# Altium schematic sheet 3S Battery Schematic.SchDoc
size A4
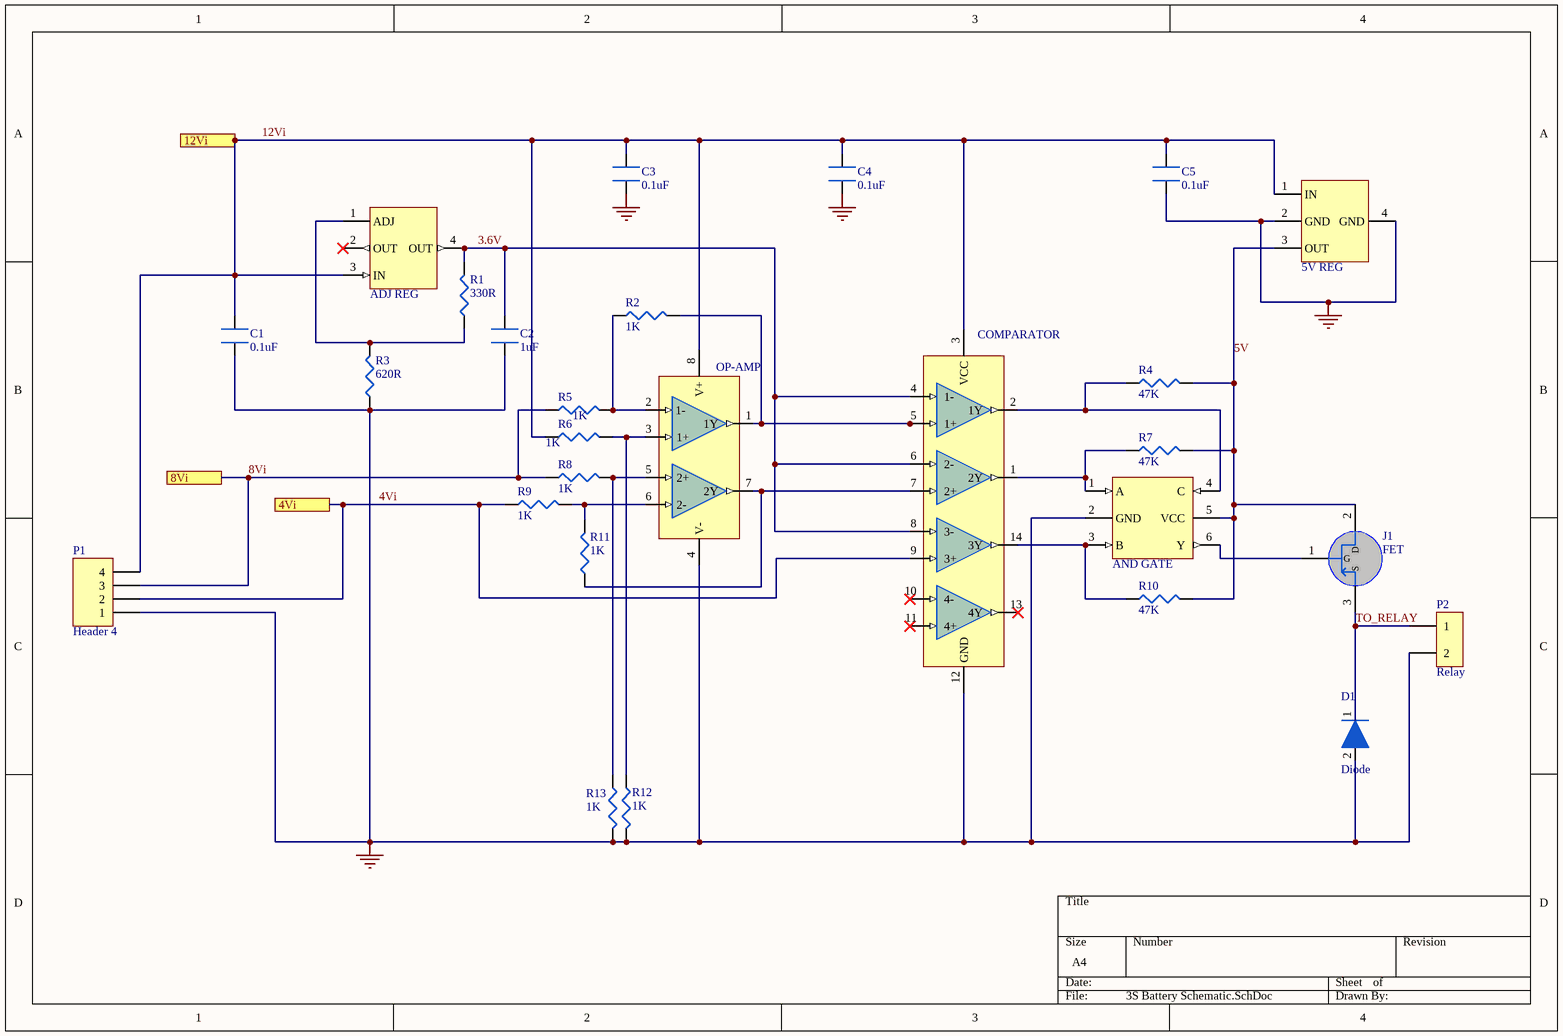
[diagram p0: 3S Battery Schematic.SchDoc]

## Parts
5VREG  5V REG  [5VREG]
ADJ1  ADJ REG  [ADJREG]
AND1  AND GATE  [AND3]
C1  0.1uF  [C1206]
C2  1uF  [C1206]
C3  0.1uF  [C1206]
C4  0.1uF  [C1206]
C5  0.1uF  [C1206]
COMP1  COMPARATOR  [Comparator]
D1  Diode  [Diode]
J1  FET  [MOSFET]
OPAMP1  OP-AMP  [OPAMP 2-Circuit]
P1  Header 4  [HDR1X4]
P2  Relay  [HDR1X2]
R1  330R  [R1206]
R2  1K  [R1206]
R3  620R  [R1206]
R4  47K  [R1206]
R5  1K  [R1206]
R6  1K  [R1206]
R7  47K  [R1206]
R8  1K  [R1206]
R9  1K  [R1206]
R10  47K  [R1206]
R11  1K  [R1206]
R12  1K  [R1206]
R13  1K  [R1206]

## Ports
4Vi, 8Vi, 12Vi

## Nets
GND: 5VREG.2(GND) 5VREG.4(GND) AND1.2(GND) C1.1 C2.1 C3.1 C4.1 C5.1 COMP1.12(GND) D1.2 OPAMP1.4(V-) P1.1 P2.2 R3.1 R12.2 R13.2
3.6V: ADJ1.4(OUT) C2.2 COMP1.4(1-) COMP1.6(2-) COMP1.8(3-) R1.2
4Vi: COMP1.9(3+) P1.2 R9.1 ; port 4Vi
5V: 5VREG.3(OUT) AND1.5(VCC) J1.2(D) R4.2 R7.2 R10.2
8Vi: P1.3 R5.1 R8.1 ; port 8Vi
12Vi: 5VREG.1(IN) ADJ1.3(IN) C1.2 C3.2 C4.2 C5.2 COMP1.3(VCC) OPAMP1.8(V+) P1.4 R6.1 ; port 12Vi
TO_RELAY: D1.1 J1.3(S) P2.1
NetADJ1_1: ADJ1.1(ADJ) R1.1 R3.2
NetAND1_1: AND1.1(A) COMP1.1(2Y) R7.1
NetAND1_3: AND1.3(B) COMP1.14(3Y) R10.1
NetAND1_4: AND1.4(C) COMP1.2(1Y) R4.1
NetAND1_6: AND1.6(Y) J1.1(G)
NetCOMP1_5: COMP1.5(1+) OPAMP1.1(1Y) R2.2
NetCOMP1_7: COMP1.7(2+) OPAMP1.7(2Y) R11.1
NetOPAMP1_2: OPAMP1.2(1-) R2.1 R5.2
NetOPAMP1_3: OPAMP1.3(1+) R6.2 R12.1
NetOPAMP1_5: OPAMP1.5(2+) R8.2 R13.1
NetOPAMP1_6: OPAMP1.6(2-) R9.2 R11.2

Not connected (* = marked no-connect by the designer): ADJ1 2(OUT)*; COMP1 10(4-)* 11(4+)* 13(4Y)*

## Library data of the parts
5VREG = LM7805MPX/NOPB: IC REG LINEAR 5V 1.5A SOT223-4; Manufacturer: Texas Instruments; Quiescent Current: 8mA; Dropout Voltage: 2V; Supplier 1: Digi-Key; Supplier Part Number 1: 296-44518-1-ND; Manufacturer Part Number: LM7805MPX/NOPB; RoHS: No; Category: Voltage Regulators - Linear; Stock 1: 3420; Pricing 1: 1=1.32000, 10=1.18000, 25=1.12000, 100=0.86000, 250=0.76000, 500=0.72000, 1000=0.56000 (USD); Min Operating Temperature: 0°C; Max Operating Temperature: 125°C; Lead Free: Lead Free
ADJ1 = LM317DCYR: TEXAS INSTRUMENTS - LM317DCYR - LINEAR VOLT REG, 1.5A, 1.25V-37V, SOT223; Power Supply Rejection Ratio (PSRR): 64dB; Output Type: Adjustable; Number of Regulators: 1; Polarity: Positive; Reference Voltage: 1.3V; Min Output Voltage: 1.25V; Max Output Voltage: 37V; Quiescent Current: 3.5mA; Dropout Voltage: 2V; Min Input Voltage: 4.2V; Max Input Voltage: 40V; Supplier 1: Digi-Key; Supplier Part Number 1: 296-12602-1-ND; Manufacturer: Texas Instruments; Manufacturer Part Number: LM317DCYR; RoHS: Yes; Category: Voltage Regulators - Linear; Stock 1: 100644; Pricing 1: 1=0.60000, 10=0.52800, 25=0.49600, 100=0.37600, 250=0.32000, 500=0.30400, 1000=0.23200 (USD); Mount: Surface Mount; Case/Package: SOT-223; Number of Pins: 4; Weight: 0.006632oz; Contact Plating: Tin,Matte; Min Operating Temperature: 0°C; Max Operating Temperature: 125°C; Number of Outputs: 1; Output Voltage: 37V; Packaging: Tape and Reel; Output Current: 1.5A; Max Output Current: 1.5A; Package Quantity: 1; Length: 6.5mm; Height: 1.6mm; Width: 3.5mm; Radiation Hardening: No; REACH SVHC: No SVHC; Lead Free: Lead Free; ComponentLink1URL: https://datasheet.ciiva.com/2042/lm317-2042144.pdf?src-supplier=Digi-Key; ComponentLink1Description: https://datasheet.ciiva.com/2042/lm317-2042144.pdf?src-supplier=Digi-Key; ComponentLink2URL: https://datasheet.ciiva.com/4882/slvs044u-120651-4882417.pdf?src-supplier=Mouser; ComponentLink2Description: https://datasheet.ciiva.com/4882/slvs044u-120651-4882417.pdf?src-supplier=Mouser; ComponentLink3URL: https://datasheet.ciiva.com/41458/001014031-da-01-en-ic-reg-adj-1-5a-lm317dcyr-sot-223-4-tid-41458183.pdf?src-supplier=Conrad; ComponentLink3Description: https://datasheet.ciiva.com/41458/001014031-da-01-en-ic-reg-adj-1-5a-lm317dcyr-sot-223-4-tid-41458183.pdf?src-supplier=Conrad; ComponentLink4URL: https://datasheet.ciiva.com/2042/lm317-2042145.pdf?src-supplier=Digi-Key; ComponentLink4Description: https://datasheet.ciiva.com/2042/lm317-2042145.pdf?src-supplier=Digi-Key; ComponentLink5URL: https://datasheet.ciiva.com/2042/lm317-2042146.pdf?src-supplier=Digi-Key; ComponentLink5Description: https://datasheet.ciiva.com/2042/lm317-2042146.pdf?src-supplier=Digi-Key; ComponentLink6URL: https://datasheet.ciiva.com/46385/1885815-46385689.pdf?src-supplier=Element14; ComponentLink6Description: https://datasheet.ciiva.com/46385/1885815-46385689.pdf?src-supplier=Element14
AND1 = SN74LVC1G11DCKR: IC GATE AND 1CH 3-INP SC-70-6; Manufacturer: Texas Instruments; Number of Elements: 1; Propagation Delay: 3.5ns; Max Supply Voltage: 5.5V; Min Supply Voltage: 1.65V; Number of Inputs: 3; Output Current: 32mA; Quiescent Current: 10uA; High Level Output Current: -32mA; Turn-On Delay Time: 4.9ns; Schmitt Trigger Input: No; Supplier 1: Digi-Key; Supplier Part Number 1: 296-18066-1-ND; Manufacturer Part Number: SN74LVC1G11DCKR; RoHS: Yes; Category: Logic Gates; Stock 1: 75205; Pricing 1: 1=0.43000, 10=0.32000, 25=0.28000, 100=0.18120, 250=0.15000, 500=0.12000, 1000=0.09200 (USD); Mount: Surface Mount; Case/Package: SC; Number of Pins: 6; Weight: 8.8E-05oz; Contact Plating: Gold; Min Operating Temperature: -40°C; Max Operating Temperature: 125°C; Package Quantity: 1; Packaging: Tape and Reel; Logic Function: AND; Number of Outputs: 1; Number of Circuits: 1; Low Level Output Current: 32mA; Number of Gates: 1; Number of Input Lines: 3; Number of Output Lines: 1; Number of Bits: 1; Length: 2mm; Height: 0.9mm; Width: 1.25mm; Radiation Hardening: No; REACH SVHC: No SVHC; Lead Free: Lead Free; ComponentLink1URL: https://datasheet.ciiva.com/4216/901sn74lvc1g11-4216653.pdf?src-supplier=Arrow; ComponentLink1Description: https://datasheet.ciiva.com/4216/901sn74lvc1g11-4216653.pdf?src-supplier=Arrow; ComponentLink2URL: https://datasheet.ciiva.com/34301/756561-34301472.pdf?src-supplier=Jameco; ComponentLink2Description: https://datasheet.ciiva.com/34301/756561-34301472.pdf?src-supplier=Jameco; ComponentLink3URL: https://datasheet.ciiva.com/15090/getdatasheetpartid-173081-15090972.pdf?src-supplier=Verical; ComponentLink3Description: https://datasheet.ciiva.com/15090/getdatasheetpartid-173081-15090972.pdf?src-supplier=Verical; ComponentLink4URL: https://datasheet.ciiva.com/14290/sn74lvc1g11-14290749.pdf?src-supplier=Avnet; ComponentLink4Description: https://datasheet.ciiva.com/14290/sn74lvc1g11-14290749.pdf?src-supplier=Avnet; ComponentLink5URL: https://datasheet.ciiva.com/1864/sn74lvc1g11-1864149.pdf?src-supplier=Digi-Key; ComponentLink5Description: https://datasheet.ciiva.com/1864/sn74lvc1g11-1864149.pdf?src-supplier=Digi-Key; ComponentLink6URL: https://datasheet.ciiva.com/1864/sn74lvc1g11-1864150.pdf?src-supplier=Digi-Key; ComponentLink6Description: https://datasheet.ciiva.com/1864/sn74lvc1g11-1864150.pdf?src-supplier=Digi-Key; ComponentLink7URL: https://datasheet.ciiva.com/1864/sn74lvc1g11-1864151.pdf?src-supplier=Digi-Key; ComponentLink7Description: https://datasheet.ciiva.com/1864/sn74lvc1g11-1864151.pdf?src-supplier=Digi-Key; ComponentLink8URL: https://datasheet.ciiva.com/26218/sn74lvc1g11-26218392.pdf?src-supplier=Avnet+Europe; ComponentLink8Description: https://datasheet.ciiva.com/26218/sn74lvc1g11-26218392.pdf?src-supplier=Avnet+Europe; ComponentLink9URL: https://datasheet.ciiva.com/7783/sn74lvc1g11-7783449.pdf?src-supplier=Element14; ComponentLink9Description: https://datasheet.ciiva.com/7783/sn74lvc1g11-7783449.pdf?src-supplier=Element14; ComponentLink10URL: https://datasheet.ciiva.com/28695/1882071-28695898.pdf?src-supplier=Element14; ComponentLink10Description: https://datasheet.ciiva.com/28695/1882071-28695898.pdf?src-supplier=Element14; ComponentLink11URL: https://datasheet.ciiva.com/46439/1856273-46439162.pdf?src-supplier=Element14; ComponentLink11Description: https://datasheet.ciiva.com/46439/1856273-46439162.pdf?src-supplier=Element14; ComponentLink12URL: https://datasheet.ciiva.com/46439/1856273-46439210.pdf?src-supplier=Element14; ComponentLink12Description: https://datasheet.ciiva.com/46439/1856273-46439210.pdf?src-supplier=Element14
C1 C3-C5 = C1206C104K5RAC-TU: Kemet 0.1µF ±10% 50V dc X7R Dielectric SMD Ceramic Multilayer Capacitor; 1206 pa; Capacitance: 100nF; Supplier 1: Digi-Key; Supplier Part Number 1: 399-C1206C104K5RAC7800CT-ND; Manufacturer: KEMET; Manufacturer Part Number: C1206C104K5RAC-TU; RoHS: Yes; Category: Ceramic Capacitors; Stock 1: 1706426; Pricing 1: 1=0.12000, 10=0.08400, 50=0.04760, 100=0.03950, 500=0.02768, 1000=0.02291 (USD); Mount: Surface Mount; Case/Package: 1206; Number of Pins: 2; Case Code (Imperial): 1206; Case Code (Metric): 3216; Contact Plating: Tin,Matte; Dielectric Material: Ceramic; Min Operating Temperature: -55°C; Max Operating Temperature: 125°C; Packaging: Tape and Reel; Tolerance: 10%; Voltage Rating (DC): 50V; Dielectric: X7R; Voltage Rating: 50V; Package Quantity: 4000; Termination: SMD/SMT; Voltage: 50V; Length: 3.2mm; Height: 0.78mm; Width: 1.6mm; Depth: 1.6mm; Radiation Hardening: No; REACH SVHC: No SVHC; ComponentLink1URL: https://datasheet.ciiva.com/6125/1725438-6125494.pdf?src-supplier=Farnell; ComponentLink1Description: https://datasheet.ciiva.com/6125/1725438-6125494.pdf?src-supplier=Farnell; ComponentLink2URL: https://datasheet.ciiva.com/6125/kem-c1002-x7r-smd-6125493.pdf?src-supplier=Farnell; ComponentLink2Description: https://datasheet.ciiva.com/6125/kem-c1002-x7r-smd-6125493.pdf?src-supplier=Farnell; ComponentLink3URL: https://datasheet.ciiva.com/14584/70095383-14584998.pdf?src-supplier=Allied+Electronics; ComponentLink3Description: https://datasheet.ciiva.com/14584/70095383-14584998.pdf?src-supplier=Allied+Electronics; ComponentLink4URL: https://datasheet.ciiva.com/6094/kem-c1002-x7r-smd-6094137.pdf?src-supplier=Farnell; ComponentLink4Description: https://datasheet.ciiva.com/6094/kem-c1002-x7r-smd-6094137.pdf?src-supplier=Farnell; ComponentLink5URL: https://datasheet.ciiva.com/14589/70095383-14589050.pdf?src-supplier=Allied+Electronics; ComponentLink5Description: https://datasheet.ciiva.com/14589/70095383-14589050.pdf?src-supplier=Allied+Electronics; ComponentLink6URL: https://datasheet.ciiva.com/7729/1851736-7729804.pdf?src-supplier=Element14; ComponentLink6Description: https://datasheet.ciiva.com/7729/1851736-7729804.pdf?src-supplier=Element14; ComponentLink7URL: https://datasheet.ciiva.com/7730/kem-c1002-x7r-smd-7730076.pdf?src-supplier=Element14; ComponentLink7Description: https://datasheet.ciiva.com/7730/kem-c1002-x7r-smd-7730076.pdf?src-supplier=Element14; ComponentLink8URL: https://datasheet.ciiva.com/7729/1851736-7729805.pdf?src-supplier=Element14; ComponentLink8Description: https://datasheet.ciiva.com/7729/1851736-7729805.pdf?src-supplier=Element14; ComponentLink9URL: https://datasheet.ciiva.com/7730/kem-c1002-x7r-smd-7730077.pdf?src-supplier=Element14; ComponentLink9Description: https://datasheet.ciiva.com/7730/kem-c1002-x7r-smd-7730077.pdf?src-supplier=Element14; ComponentLink10URL: https://datasheet.ciiva.com/32426/slceramic-chip-condensers-e-32426463.pdf?src-supplier=Distrelec; ComponentLink10Description: https://datasheet.ciiva.com/32426/slceramic-chip-condensers-e-32426463.pdf?src-supplier=Distrelec; ComponentLink11URL: https://datasheet.ciiva.com/5423/kem-c1002-x7r-smd-5423254.pdf?src-supplier=Mouser; ComponentLink11Description: https://datasheet.ciiva.com/5423/kem-c1002-x7r-smd-5423254.pdf?src-supplier=Mouser; ComponentLink12URL: https://datasheet.ciiva.com/28682/1851736-28682249.pdf?src-supplier=Element14; ComponentLink12Description: https://datasheet.ciiva.com/28682/1851736-28682249.pdf?src-supplier=Element14
C2 = C1206C105M4RACTU: KEMET         C1206C105M4RACTU             SMD Multilayer Ceramic Capacitor, 1206 [3216 Metric], 1 F, 16 V,  20%, X7R, C Series                          New; Voltage Rating: 16V; Supplier 1: Digi-Key; Supplier Part Number 1: 399-8150-1-ND; Manufacturer: KEMET; Manufacturer Part Number: C1206C105M4RACTU; RoHS: Yes; Category: Ceramic Capacitors; Stock 1: 36978; Pricing 1: 1=0.19000, 10=0.12600, 50=0.07560, 100=0.06390, 500=0.04372, 1000=0.03868 (USD); Mount: Surface Mount; Case/Package: 1206; Dielectric Material: Ceramic; Case Code (Imperial): 1206; Case Code (Metric): 3216; Min Operating Temperature: -55°C; Max Operating Temperature: 125°C; Termination: SMD/SMT; Dielectric: X7R; Capacitance: 1uF; Tolerance: 20%; Packaging: Tape and Reel; Package Quantity: 1; Voltage Rating (DC): 16V; Length: 3.2mm; Height: 1.2mm; Thickness: 0.055inch; Depth: 1.6mm; Width: 0.063inch; Radiation Hardening: No; REACH SVHC: No SVHC; ComponentLink1URL: http://components.arrow.com/part/dataview/0323_00341530?src-supplier=Arrow+Europe; ComponentLink1Description: http://components.arrow.com/part/dataview/0323_00341530?src-supplier=Arrow+Europe; ComponentLink2URL: http://www.farnell.com/datasheets/2746114.pdf?src-supplier=Farnell; ComponentLink2Description: http://www.farnell.com/datasheets/2746114.pdf?src-supplier=Farnell; ComponentLink3URL: http://www.mouser.com/ds/2/212/KEM_C1002_X7R_SMD-1102033.pdf?src-supplier=Mouser; ComponentLink3Description: http://www.mouser.com/ds/2/212/KEM_C1002_X7R_SMD-1102033.pdf?src-supplier=Mouser; ComponentLink4URL: http://www.farnell.com/datasheets/2746114.pdf?src-supplier=Newark; ComponentLink4Description: http://www.farnell.com/datasheets/2746114.pdf?src-supplier=Newark; ComponentLink5URL: http://www.farnell.com/datasheets/1828800.pdf?src-supplier=Newark; ComponentLink5Description: http://www.farnell.com/datasheets/1828800.pdf?src-supplier=Newark; ComponentLink6URL: https://api.kemet.com/component-edge/download/datasheet/C1206C105M4RACTU.pdf?src-supplier=Digi-Key; ComponentLink6Description: https://api.kemet.com/component-edge/download/datasheet/C1206C105M4RACTU.pdf?src-supplier=Digi-Key; ComponentLink7URL: http://components.arrow.com/part/dataview/2096582S3494707N7429?src-supplier=Arrow; ComponentLink7Description: http://components.arrow.com/part/dataview/2096582S3494707N7429?src-supplier=Arrow; ComponentLink8URL: https://search.kemet.com/component-edge/download/datasheet/C1206C105M4RACTU.pdf?src-supplier=Digi-Key; ComponentLink8Description: https://search.kemet.com/component-edge/download/datasheet/C1206C105M4RACTU.pdf?src-supplier=Digi-Key; ComponentLink9URL: https://www.verical.com/server-webapp/html/getDatasheet?partID=110809&src-supplier=Verical; ComponentLink9Description: https://www.verical.com/server-webapp/html/getDatasheet?partID=110809&src-supplier=Verical; ComponentLink10URL: http://www.farnell.com/datasheets/2065007.pdf?src-supplier=Element14; ComponentLink10Description: http://www.farnell.com/datasheets/2065007.pdf?src-supplier=Element14
COMP1 = LM339DR: Comparator Quad 15V/30V 14-Pin SOIC T/R; Manufacturer: Texas Instruments; Voltage Gain: 106.02dB; Min Supply Voltage: 2V; Max Supply Voltage: 30V; Min Dual Supply Voltage: 1V; Max Dual Supply Voltage: 15V; Nominal Supply Current: 2mA; Number of Elements: 4; Max Supply Current: 500uA; Input Bias Current: 250nA; Output Current per Channel: 6mA; Input Offset Voltage (Vos): 5mV; Response Time: 1.3us; Output Current: 20mA; Quiescent Current: 2.5mA; Output Type: TTL; Supplier 1: Digi-Key; Supplier Part Number 1: 296-1013-1-ND; Manufacturer Part Number: LM339DR; RoHS: Yes; Category: Amplifiers - Op Amps, Buffer, Instrumentation; Stock 1: 39253; Pricing 1: 1=0.38000, 10=0.28700, 25=0.25840, 100=0.14100, 250=0.13632, 500=0.12220, 1000=0.09400 (USD); Mount: Surface Mount; Case/Package: SOIC; Number of Pins: 14; Weight: 0.004318oz; Contact Plating: Gold; Min Operating Temperature: 0°C; Max Operating Temperature: 70°C; Packaging: Tape and Reel; Package Quantity: 2500; Number of Channels: 4; Max Input Current: 250nA; Radiation Hardening: No; Lead Free: Lead Free; REACH SVHC: No SVHC; ComponentLink1URL: https://datasheet.ciiva.com/15131/getdatasheetpartid-242797-15131064.pdf?src-supplier=Verical; ComponentLink1Description: https://datasheet.ciiva.com/15131/getdatasheetpartid-242797-15131064.pdf?src-supplier=Verical; ComponentLink2URL: https://datasheet.ciiva.com/34301/902741-34301710.pdf?src-supplier=Jameco; ComponentLink2Description: https://datasheet.ciiva.com/34301/902741-34301710.pdf?src-supplier=Jameco; ComponentLink3URL: https://datasheet.ciiva.com/2970/lm2901-2970486.pdf?src-supplier=Avnet; ComponentLink3Description: https://datasheet.ciiva.com/2970/lm2901-2970486.pdf?src-supplier=Avnet; ComponentLink4URL: https://datasheet.ciiva.com/2970/lm2901-2970487.pdf?src-supplier=Avnet; ComponentLink4Description: https://datasheet.ciiva.com/2970/lm2901-2970487.pdf?src-supplier=Avnet; ComponentLink5URL: https://datasheet.ciiva.com/46390/1874704-46390521.pdf?src-supplier=Element14; ComponentLink5Description: https://datasheet.ciiva.com/46390/1874704-46390521.pdf?src-supplier=Element14; ComponentLink6URL: https://datasheet.ciiva.com/1483/1633630-1483053.pdf?src-supplier=Element14; ComponentLink6Description: https://datasheet.ciiva.com/1483/1633630-1483053.pdf?src-supplier=Element14; ComponentLink7URL: https://datasheet.ciiva.com/1827/lm139a-1827181.pdf?src-supplier=Digi-Key; ComponentLink7Description: https://datasheet.ciiva.com/1827/lm139a-1827181.pdf?src-supplier=Digi-Key; ComponentLink8URL: https://datasheet.ciiva.com/1827/lm139a-1827182.pdf?src-supplier=Digi-Key; ComponentLink8Description: https://datasheet.ciiva.com/1827/lm139a-1827182.pdf?src-supplier=Digi-Key; ComponentLink9URL: https://datasheet.ciiva.com/1827/lm139a-1827183.pdf?src-supplier=Digi-Key; ComponentLink9Description: https://datasheet.ciiva.com/1827/lm139a-1827183.pdf?src-supplier=Digi-Key; ComponentLink10URL: https://datasheet.ciiva.com/16464/lm2901-16464303.pdf?src-supplier=Avnet+Asia; ComponentLink10Description: https://datasheet.ciiva.com/16464/lm2901-16464303.pdf?src-supplier=Avnet+Asia; ComponentLink11URL: https://datasheet.ciiva.com/48711/001072944-da-01-en-ic-quad-diff-comp-lm339dr-soic-14-tid-48711414.pdf?src-supplier=Conrad; ComponentLink11Description: https://datasheet.ciiva.com/48711/001072944-da-01-en-ic-quad-diff-comp-lm339dr-soic-14-tid-48711414.pdf?src-supplier=Conrad
D1 = S1B: ON SEMICONDUCTOR - S1B - Standard Recovery Diode, General Purpose, 100 V, 1 A, Single, 1.1 V, 1.8 µs, 30 A; Manufacturer: ON Semiconductor / Fairchild; Forward Voltage: 1.1V; Voltage Rating (DC): 100V; Current Rating: 1A; Capacitance: 12pF; Reverse Recovery Time: 1.8us; Max Surge Current: 40A; Peak Reverse Current: 1uA; Recovery Time: 1800ns; Power Dissipation: 1.4W; Peak Non-Repetitive Surge Current: 30A; Supplier 1: Digi-Key; Supplier Part Number 1: S1BFSCT-ND; Manufacturer Part Number: S1B; RoHS: Yes; Category: Rectifier Diodes; Stock 1: 104255; Pricing 1: 1=0.24000, 10=0.19200, 25=0.16120, 100=0.07880, 500=0.06570, 1000=0.04565, 2500=0.04242 (USD); Mount: Surface Mount; Case/Package: SMA; Number of Pins: 2; Weight: 0.106g; Contact Plating: Tin,Matte; Min Operating Temperature: -55°C; Max Operating Temperature: 150°C; Packaging: Tape and Reel; Polarity: Standard; Output Current: 1A; Max Repetitive Reverse Voltage (Vrrm): 100V; Reverse Voltage: 100V; Package Quantity: 1; Forward Current: 1A; Element Configuration: Single; Average Rectified Current: 1A; Max Forward Surge Current (Ifsm): 30A; Max Reverse Voltage (DC): 100V; Length: 4.75mm; Height: 2.2mm; Width: 2.95mm; Radiation Hardening: No; Lead Free: Lead Free; REACH SVHC: No SVHC; ComponentLink1URL: https://datasheet.ciiva.com/4452/s1b-196602-4452914.pdf?src-supplier=Mouser; ComponentLink1Description: https://datasheet.ciiva.com/4452/s1b-196602-4452914.pdf?src-supplier=Mouser; ComponentLink2URL: https://datasheet.ciiva.com/25624/0900766b810e25be-25624908.pdf?src-supplier=RSComponents; ComponentLink2Description: https://datasheet.ciiva.com/25624/0900766b810e25be-25624908.pdf?src-supplier=RSComponents; ComponentLink3URL: https://datasheet.ciiva.com/916/s1a-916901.pdf?src-supplier=Digi-Key; ComponentLink3Description: https://datasheet.ciiva.com/916/s1a-916901.pdf?src-supplier=Digi-Key; ComponentLink4URL: https://datasheet.ciiva.com/916/s1a-916902.pdf?src-supplier=Digi-Key; ComponentLink4Description: https://datasheet.ciiva.com/916/s1a-916902.pdf?src-supplier=Digi-Key; ComponentLink5URL: https://datasheet.ciiva.com/916/s1a-916903.pdf?src-supplier=Digi-Key; ComponentLink5Description: https://datasheet.ciiva.com/916/s1a-916903.pdf?src-supplier=Digi-Key
J1 = DMN65D8L-7: N-Channel Enhancement MOSFET SOT-23; Manufacturer: Diodes; FET Type: 1 N-Channel; Number of Channels: 1; Rise Time: 2.8ns; Rds On Max: 3R; Input Capacitance: 22pF; Element Configuration: Single; Gate to Source Voltage (Vgs): 20V; Drain to Source Voltage (Vdss): 60V; Continuous Drain Current (ID): 310mA; Max Power Dissipation: 370mW; Drain to Source Resistance: 2R; Power Dissipation: 540mW; Turn-Off Delay Time: 12.6ns; Turn-On Delay Time: 2.7ns; Threshold Voltage: 2V; Supplier 1: Digi-Key; Supplier Part Number 1: DMN65D8L-7DICT-ND; Manufacturer Part Number: DMN65D8L-7; RoHS: Yes; Category: MOSFETs; Stock 1: 514497; Pricing 1: 1=0.17000, 10=0.15100, 25=0.14400, 100=0.06330, 250=0.06076, 500=0.04972, 1000=0.03453 (USD); Mount: Surface Mount; Case/Package: SOT-23; Number of Pins: 3; Weight: 0.000282oz; Min Operating Temperature: -55°C; Max Operating Temperature: 150°C; Packaging: Tape and Reel; Package Quantity: 1; Drain to Source Breakdown Voltage: 60V; Number of Elements: 1; Length: 3mm; Height: 1.1mm; Width: 1.4mm; Lead Free: Lead Free; REACH SVHC: No SVHC; ComponentLink1URL: https://datasheet.ciiva.com/6371/dmn65d8l-6371124.pdf?src-supplier=Digi-Key; ComponentLink1Description: https://datasheet.ciiva.com/6371/dmn65d8l-6371124.pdf?src-supplier=Digi-Key; ComponentLink2URL: https://datasheet.ciiva.com/13058/dmn65d8l-219098-13058455.pdf?src-supplier=Mouser; ComponentLink2Description: https://datasheet.ciiva.com/13058/dmn65d8l-219098-13058455.pdf?src-supplier=Mouser; ComponentLink3URL: https://datasheet.ciiva.com/6371/dmn65d8l-6371126.pdf?src-supplier=Digi-Key; ComponentLink3Description: https://datasheet.ciiva.com/6371/dmn65d8l-6371126.pdf?src-supplier=Digi-Key; ComponentLink4URL: https://datasheet.ciiva.com/6371/dmn65d8l-6371128.pdf?src-supplier=Digi-Key; ComponentLink4Description: https://datasheet.ciiva.com/6371/dmn65d8l-6371128.pdf?src-supplier=Digi-Key
OPAMP1 = LMC662AIMX/NOPB: TEXAS INSTRUMENTS   LMC662AIMX/NOPB   OP-AMP, 1.4MHZ, 1.1V/US, SOIC-8; Max Supply Voltage: 15.5V; Min Supply Voltage: 4.75V; Voltage Gain: 126.02dB; Number of Circuits: 2; Output Current: 21mA; Slew Rate: 1.1V/µs; Common Mode Rejection Ratio: 70dB; Input Offset Voltage (Vos): 3mV; Supplier 1: Digi-Key; Supplier Part Number 1: LMC662AIMX/NOPBCT-ND; Manufacturer: Texas Instruments; Manufacturer Part Number: LMC662AIMX/NOPB; RoHS: Yes; Category: Amplifiers - Op Amps, Buffer, Instrumentation; Stock 1: 33461; Pricing 1: 1=1.73000, 10=1.55600, 25=1.46760, 100=1.17400, 250=1.02724, 500=0.99790, 1000=0.79245 (USD); Mount: Surface Mount; Case/Package: SOIC; Number of Pins: 8; Min Operating Temperature: -40°C; Max Operating Temperature: 85°C; Gain Bandwidth Product: 1.4MHz; Number of Channels: 2; Unity Gain Bandwidth Product: 1.4MHz; Packaging: Tape and Reel; Bandwidth: 1.4MHz; Number of Amplifiers: 2; Number of Elements: 2; Power Supply Rejection Ratio (PSRR): 70dB; Lead Free: Lead Free; REACH SVHC: No SVHC; ComponentLink1URL: http://components.arrow.com/part/dataview/53774360S9849188N1317?src-supplier=Arrow; ComponentLink1Description: http://components.arrow.com/part/dataview/53774360S9849188N1317?src-supplier=Arrow; ComponentLink2URL: http://components.arrow.com/part/dataview/0323_00059640?src-supplier=Arrow+Europe; ComponentLink2Description: http://components.arrow.com/part/dataview/0323_00059640?src-supplier=Arrow+Europe; ComponentLink3URL: http://www.ti.com/general/docs/lit/getliterature.tsp?genericPartNumber=LMC662&&fileType=pdf&src-supplier=Avnet; ComponentLink3Description: http://www.ti.com/general/docs/lit/getliterature.tsp?genericPartNumber=LMC662&&fileType=pdf&src-supplier=Avnet; ComponentLink4URL: http://www.ti.com/lit/ds/symlink/lmc662.pdf?src-supplier=Digi-Key; ComponentLink4Description: http://www.ti.com/lit/ds/symlink/lmc662.pdf?src-supplier=Digi-Key; ComponentLink5URL: http://www.farnell.com/datasheets/1839249.pdf?src-supplier=Element14; ComponentLink5Description: http://www.farnell.com/datasheets/1839249.pdf?src-supplier=Element14; ComponentLink6URL: http://www.ti.com/general/docs/lit/getliterature.tsp?genericPartNumber=LMC662&&fileType=pdf&src-supplier=Farnell; ComponentLink6Description: http://www.ti.com/general/docs/lit/getliterature.tsp?genericPartNumber=LMC662&&fileType=pdf&src-supplier=Farnell; ComponentLink7URL: http://www.ti.com/litv/SNOSC51B?src-supplier=Mouser; ComponentLink7Description: http://www.ti.com/litv/SNOSC51B?src-supplier=Mouser; ComponentLink8URL: http://www.ti.com/general/docs/suppproductinfo.tsp?distId=10&amp;gotoUrl=http%3A%2F%2Fwww.ti.com%2Flit%2Fgpn%2Flmc662&src-supplier=Digi-Key; ComponentLink8Description: http://www.ti.com/general/docs/suppproductinfo.tsp?distId=10&amp;gotoUrl=http%3A%2F%2Fwww.ti.com%2Flit%2Fgpn%2Flmc662&src-supplier=Digi-Key; ComponentLink9URL: http://www.farnell.com/datasheets/1888942.pdf?src-supplier=Element14; ComponentLink9Description: http://www.farnell.com/datasheets/1888942.pdf?src-supplier=Element14
P1 = Header 4: Header, 4-Pin; LatestRevisionDate: 17-Jul-2002; LatestRevisionNote: Re-released for DXP Platform.; Publisher: Altium Limited
P2 = 22-29-2021: Conn Wire to Board HDR 2 POS 2.54mm Solder ST Thru-Hole Bag; Manufacturer: Molex; Number of Positions: 2; Connector Type: Header,Male Pin; Gender: Male; Voltage Rating (DC): 250V; Contact Post Length: 0.14inch; Glow Wire Compliant: Non-compliant; Supplier 1: Digi-Key; Manufacturer Part Number: 22-29-2021; RoHS: Yes; Category: Connectors; Stock 1: 6742; Pricing 1: 1=0.48000, 10=0.45200, 100=0.31630, 500=0.27112, 1000=0.22593, 5000=0.19365, 10000=0.18074 (USD); Mount: Through Hole; Color: White; Contact Plating: Gold; Contact Material: Brass; Contact Shape: Square; Insulation Material: Nylon; Insulation Color: Natural; Max Operating Temperature: 80°C; Number of Rows: 1; Packaging: Bag; Termination: Solder; Fastening Type: Friction; Contact Mating Length: 0.295inch; Insulation Height: 0.461inch; Lead Free: Lead Free; Halogen Free: Low Halogen; Flammability Rating: UL94 V-0; ComponentLink1URL: https://datasheet.ciiva.com/70131/022292021-sd-70131706.pdf?src-supplier=Digi-Key; ComponentLink1Description: https://datasheet.ciiva.com/70131/022292021-sd-70131706.pdf?src-supplier=Digi-Key; Supplier Part Number 1: WM2744-ND
R1 = RC1206FR-07330RL: Surface Mount Thick Film Resistor, RC Series, 330 ohm, 250 mW, - 1%, 200 V, 1206 [3216 Metric]; Manufacturer: Yageo; Power Rating: 250mW; Temperature Coefficient: 100ppm/°C; Voltage Rating: 200V; Supplier 1: Digi-Key; Supplier Part Number 1: 311-330FRCT-ND; Manufacturer Part Number: RC1206FR-07330RL; RoHS: Yes; Category: Chip SMD Resistors; Stock 1: 22261; Pricing 1: 1=0.10000, 10=0.06900, 100=0.02800, 1000=0.01259, 2500=0.01092 (USD); Case/Package: 1206; Case Code (Imperial): 1206; Case Code (Metric): 3216; Min Operating Temperature: -55°C; Max Operating Temperature: 155°C; Tolerance: 1%; Resistance: 330R; Packaging: Tape and Reel; Termination: SMD/SMT; Composition: Thick Film; Length: 3.1mm; Height: 0.55mm; Depth: 1.6mm; REACH SVHC: Unknown; Lead Free: Lead Free; ComponentLink1URL: https://datasheet.ciiva.com/11819/0900766b80c6630a-11819921.pdf?src-supplier=RSComponents; ComponentLink1Description: https://datasheet.ciiva.com/11819/0900766b80c6630a-11819921.pdf?src-supplier=RSComponents; ComponentLink2URL: https://datasheet.ciiva.com/17422/pyu-rc1206-51-rohs-l-4-17422588.pdf?src-supplier=Future+Electronics; ComponentLink2Description: https://datasheet.ciiva.com/17422/pyu-rc1206-51-rohs-l-4-17422588.pdf?src-supplier=Future+Electronics
R2 R5 R6 R8 R9 R11-R13 = RC1206JR-071KL: RES SMD 1K OHM 5% 1/4W 1206; Manufacturer: Yageo; Temperature Coefficient: 100ppm/°C; Resistance: 1kR; Max Power Dissipation: 250mW; Voltage Rating: 200V; Supplier 1: Digi-Key; Supplier Part Number 1: 311-1.0KERDKR-ND; Manufacturer Part Number: RC1206JR-071KL; RoHS: Yes; Category: Chip SMD Resistors; Stock 1: 2065133; Pricing 1: 1=0.10000, 10=0.05900, 100=0.02400, 1000=0.01079, 2500=0.00936 (USD); Case/Package: 1206; Case Code (Metric): 3216; Case Code (Imperial): 1206; Min Operating Temperature: -55°C; Max Operating Temperature: 155°C; Composition: Thick Film; Tolerance: 5%; Packaging: Tape and Reel; Number of Terminations: 2; Termination: SMD/SMT; Military Standard: Not; Package Quantity: 1; Power Rating: 250mW; Length: 3.1mm; Height: 0.026inch; Width: 0.063inch; Depth: 1.6mm; Lead Free: Lead Free; REACH SVHC: Unknown; ComponentLink1URL: https://datasheet.ciiva.com/2458/pyu-r-int-thick-7-2458672.pdf?src-supplier=Digi-Key; ComponentLink1Description: https://datasheet.ciiva.com/2458/pyu-r-int-thick-7-2458672.pdf?src-supplier=Digi-Key; ComponentLink2URL: https://datasheet.ciiva.com/2458/pyu-r-int-thick-7-2458673.pdf?src-supplier=Digi-Key; ComponentLink2Description: https://datasheet.ciiva.com/2458/pyu-r-int-thick-7-2458673.pdf?src-supplier=Digi-Key; ComponentLink3URL: https://datasheet.ciiva.com/2458/pyu-r-int-thick-7-2458671.pdf?src-supplier=Digi-Key; ComponentLink3Description: https://datasheet.ciiva.com/2458/pyu-r-int-thick-7-2458671.pdf?src-supplier=Digi-Key
R3 = RMCF1206JT620R: Res Thick Film 1206 620 Ohm 5% 1/4W ±200ppm/C Molded SMD Paper T/R; Manufacturer: Stackpole Electronics; Max Power Dissipation: 250mW; Temperature Coefficient: 200ppm/°C; Supplier 1: Digi-Key; Supplier Part Number 1: RMCF1206JT620RCT-ND; Manufacturer Part Number: RMCF1206JT620R; RoHS: Yes; Category: Chip SMD Resistors; Stock 1: 44910; Pricing 1: 1=0.10000, 10=0.02700, 100=0.01100, 1000=0.00496, 2500=0.00430 (USD); Mount: Surface Mount; Case/Package: 1206; Case Code (Metric): 3216; Case Code (Imperial): 1206; Contact Plating: Tin,Matte; Min Operating Temperature: -55°C; Max Operating Temperature: 155°C; Features: Automotive AEC-Q200; Resistance: 620R; Tolerance: 5%; Packaging: Tape and Reel; Composition: Thick Film; Number of Terminations: 2; Military Standard: Not; Length: 0.126inch; Height: 0.028inch; Width: 0.063inch; Depth: 1.6mm; Radiation Hardening: No; ComponentLink1URL: https://datasheet.ciiva.com/15193/getdatasheetpartid-659413-15193755.pdf?src-supplier=Verical; ComponentLink1Description: https://datasheet.ciiva.com/15193/getdatasheetpartid-659413-15193755.pdf?src-supplier=Verical
R4 R7 R10 = CRGP1206F47K: RS20-0400S4S4SDAPHHXX.X.; Manufacturer: TE Connectivity; Supplier 1: Digi-Key; Supplier Part Number 1: A130558CT-ND; Manufacturer Part Number: CRGP1206F47K; RoHS: No; Category: Chip SMD Resistors; Stock 1: 54190; Pricing 1: 1=0.31000, 10=0.26500, 100=0.10360, 1000=0.04338, 2500=0.03976 (USD)